# Altium project WIFIOTG.PrjPcb
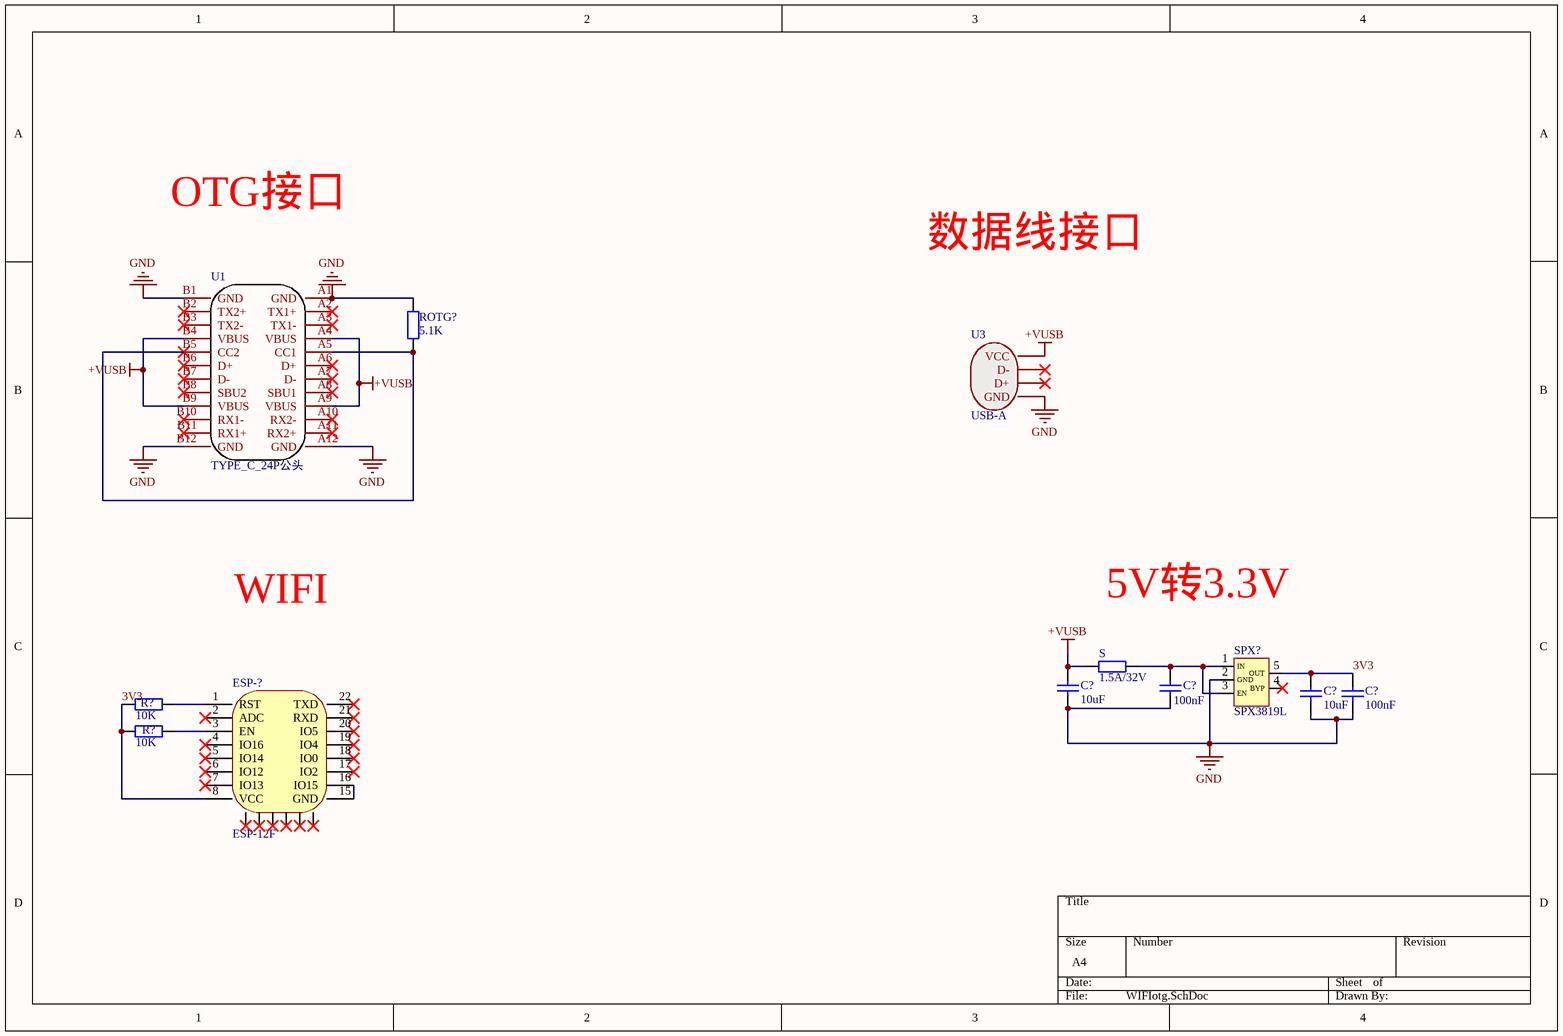
[diagram p0: WIFIotg.SchDoc]
1 sheet, 12 parts. Net scope: global (net labels, ports and power ports of the same name join across sheets).
Board file: WIFIOTG.PcbDoc

## Sheet WIFIotg.SchDoc
size A4

### Parts
(Parts that share a designator on the sheet are numbered #1, #2 ... from top to bottom, then left to right.)
C?#1  10uF  [0603 电容]
C?#2  100nF  [0603 电容]
C?#3  10uF  [0603 电容]
C?#4  100nF  [0603 电容]
ESP-?  ESP-12F  [ESP-12F]
R?#1  10K  [0603 电阻]
R?#2  10K  [0603 电阻]
ROTG?  5.1K  [0603 电阻]
S  1.5A/32V  [0603 电阻]
SPX?  SPX3819L  [SPX3819]
U1  TYPE_C_24P公头  [TYPE_C_24PIN公头]
U3  USB-A  [USB-A公头]

### Nets
+VUSB: C?#1.2 S.1 U1.A4(VBUS) U1.A9(VBUS) U1.B4(VBUS) U1.B9(VBUS) U3.1(VCC)
GND: C?#1.1 C?#2.1 C?#3.1 C?#4.1 ROTG?.2 SPX?.2(GND) U1.A1(GND) U1.A12(GND) U1.B1(GND) U1.B12(GND) U3.4(GND)
3V3: C?#3.2 C?#4.2 ESP-?.8(VCC) R?#1.1 R?#2.1 SPX?.5(OUT)
NetC?#2_2: C?#2.2 S.2 SPX?.1(IN) SPX?.3(EN)
NetESP-?_1: ESP-?.1(RST) R?#1.2
NetESP-?_3: ESP-?.3(EN) R?#2.2
NetESP-?_15: ESP-?.15(GND) ESP-?.16(IO15)
NetROTG?_1: ROTG?.1 U1.A5(CC1) U1.B5(CC2)

Not connected (* = marked no-connect by the designer): ESP-? 2(ADC)* 4(IO16)* 5(IO14)* 6(IO12)* 7(IO13)* 9* 10* 11* 12* 13* 14* 17(IO2)* 18(IO0)* 19(IO4)* 20(IO5)* 21(RXD)* 22(TXD)*; SPX? 4(BYP)*; U1 A2(TX1+)* A3(TX1-)* A6(D+)* A7(D-)* A8(SBU1)* A10(RX2-)* A11(RX2+)* B2(TX2+)* B3(TX2-)* B6(D+)* B7(D-)* B8(SBU2)* B10(RX1-)* B11(RX1+)*; U3 2(D-)* 3(D+)*

### Notes on the sheet
- OTG接口
- 数据线接口
- WIFI
- 5V转3.3V

### Library data of the parts
C?#1-C?#4 = 电容 无极
R?#1 R?#2 ROTG? S = 电阻
SPX? = SPX3819LM